# Altium schematic sheet PSU.SCHDOC: Power Supplies
size A4; Organization: Altium Limited.; Address1: Level 3, 12a Rodborough Rd; Address2: Frenchs Forest 2086; Address3: NSW; Address4: AUSTRALIA; DocumentNumber: 10; SheetNumber: 10; SheetTotal: 23
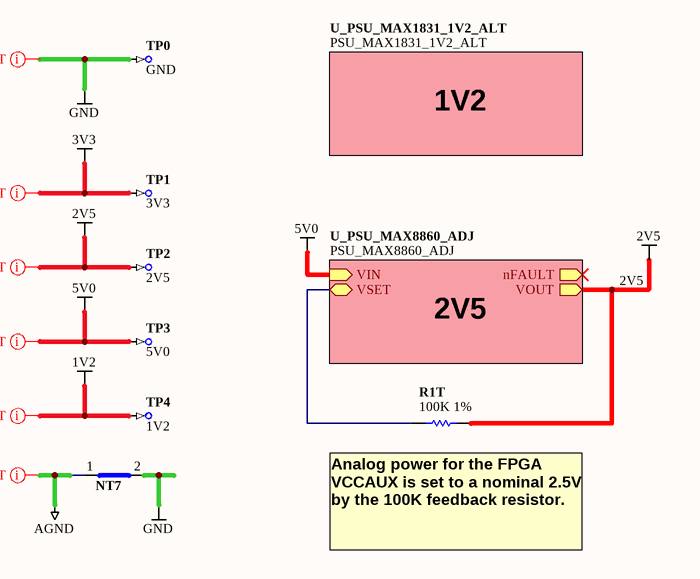
[diagram p0: PSU.SCHDOC]

## Parts
NT7  Net Tie SMT2  [NETTIE-SMT2-8X8]  (value not drawn)  (net tie, no BOM)
R1T  100K 1%  [RESC1005-STAR]
TP0  GND  [TestPin]  (no BOM)
TP1  3V3  [TestPin]  (no BOM)
TP2  2V5  [TestPin]  (no BOM)
TP3  5V0  [TestPin]  (no BOM)
TP4  1V2  [TestPin]  (no BOM)

## Sub-sheets
U_PSU_MAX1831_1V2_ALT = PSU_MAX1831_1V2_ALT: no entries
U_PSU_MAX8860_ADJ = PSU_MAX8860_ADJ: nFAULT (out), VIN (in), VOUT (out), VSET (bidir)

## Nets
1V2: TP4.1
2V5: R1T.2 TP2.1 ; sheet U_PSU_MAX8860_ADJ/VOUT
3V3: TP1.1
5V0: TP3.1 ; sheet U_PSU_MAX8860_ADJ/VIN
AGND: NT7.1(Net1)
GND: NT7.2(Net2) TP0.1
NetR1T_1: R1T.1 ; sheet U_PSU_MAX8860_ADJ/VSET

## Layout directives
net class PWRNET: 1V2, 2V5, 3V3, 5V0, AGND, GND

## Notes on the sheet
- 1V2
- 2V5
- (near R1T) Analog power for the FPGA VCCAUX is set to a nominal 2.5V by the 100K feedback resistor.
- Sheet Title
- Project Title
- Size:
- Date:
- A4
- Assy:
- Time:
- Revision:
- Sheet
- of
- File:

## Library data of the parts
NT7 = D-002-0002: Net-Tie, Surface Mount, 2 x 0.4mm x 0.2mm SMT Pads - For 0.2mm Track; Status: Production; Category: Net-Tie
R1T = D-100-0132: Resistor, 100K 1% 0402 (1005); Power Rating: 63 mW; Mounting Technology: Surface Mount; Resistance: 100 K; Status: Production; Tolerance: 1 %; Category: Resistor
TP0-TP4 = D-006-0000: Test Point, PCB Mount with Silkscreen Box; Status: Production; Category: Test-Point